# EAGLE schematic BusPirate-ultra-proto-pwr_adc.v.0 (EAGLE 9.1.3)
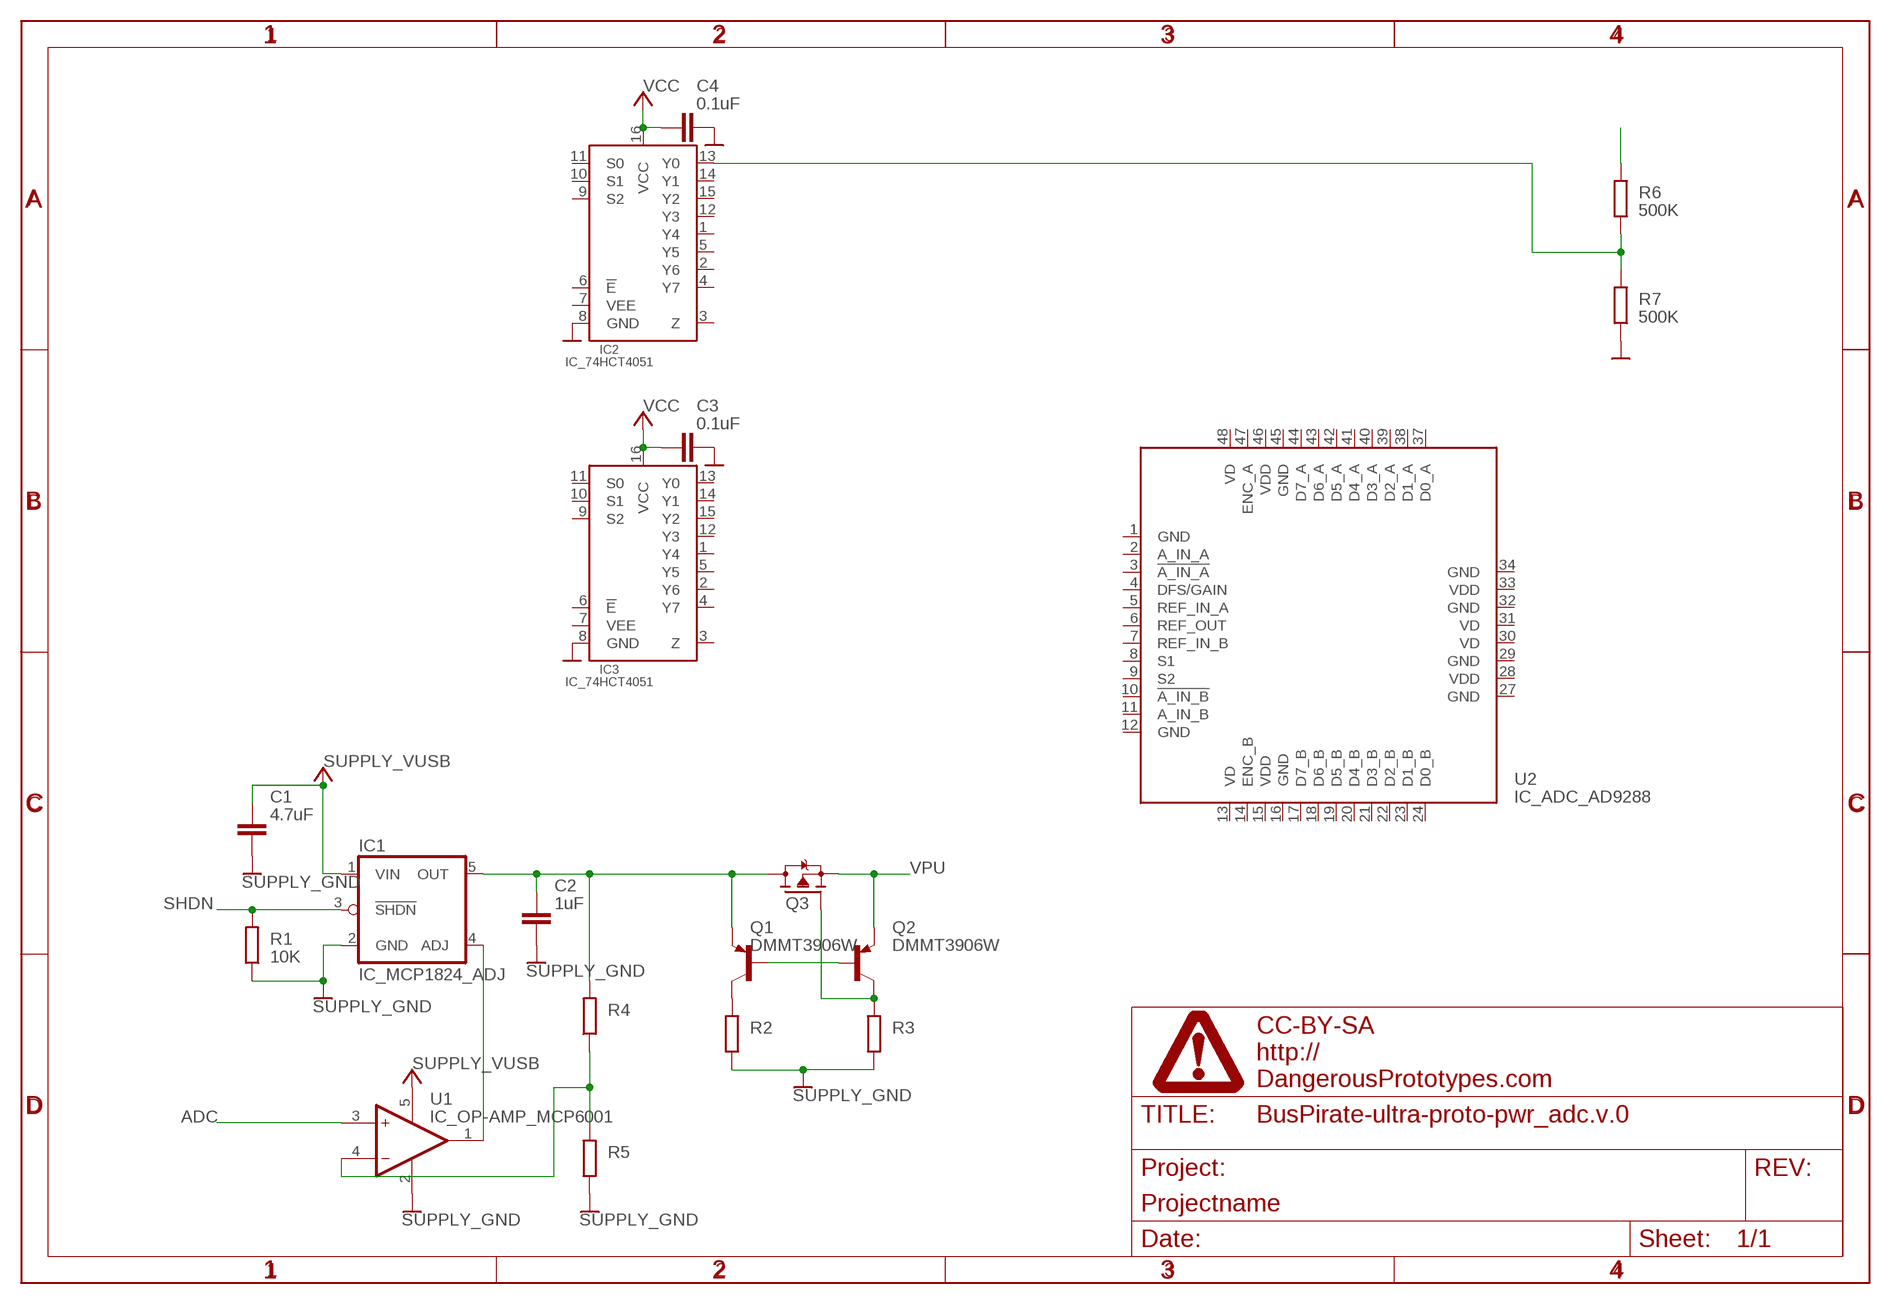
[diagram p0: schematic, sheet 1]

## Parts
C1  4.7uF  CAPACITOR_NPOL-0603  [C603]
C2  1uF  CAPACITOR_NPOL-0603  [C603]
C3  0.1uF  CAPACITOR_NPOL-0603  [C603]
C4  0.1uF  CAPACITOR_NPOL-0603  [C603]
IC1  IC_MCP1824_ADJ  [SOT-23-5]
IC2  IC_74HCT4051  [TSSOP-16]
IC3  IC_74HCT4051  [TSSOP-16]
PAGE1  FRAME_DINA4_L  [DP_LOGO]
Q1  DMMT3906W  TRANSISTOR_BJT_PNP-SOT-23-EBC  [SOT-23]
Q2  DMMT3906W  TRANSISTOR_BJT_PNP-SOT-23-EBC  [SOT-23]
Q3  TRANSISTOR_FET_TSM2301CX  [SOT-23]
R1  10K  RESISTOR-0603  [R603]
R2  RESISTOR-0603  [R603]
R3  RESISTOR-0603  [R603]
R4  RESISTOR-0603  [R603]
R5  RESISTOR-0603  [R603]
R6  500K  RESISTOR-0603  [R603]
R7  500K  RESISTOR-0603  [R603]
U1  IC_OP-AMP_MCP6001  [SOT-23-5]
U2  IC_ADC_AD9288  [LQFP48]

## Nets
ADC: U1.3(+)
GND: C1.2 C2.2 C3.2 C4.2 IC1.2(GND) IC2.8(GND) IC3.8(GND) R1.1 R2.1 R3.1 R5.1 R7.1 U1.2(V-) ; supply symbol labelled SUPPLY_GND
N$1: C2.1 IC1.5(OUT) Q1.1(E) Q3.3(D) R4.2
N$2: IC2.13(Y0) R6.1 R7.2
N$3: Q1.3(C) R2.2
N$4: Q2.3(C) Q3.1(G) R3.2
N$5: Q1.2(B) Q2.2(B)
N$6: IC1.4(ADJ) U1.1(OUT)
N$7: R4.1 R5.2 U1.4(-)
N$8: R6.2
SHDN: IC1.3(!SHDN) R1.2
VCC: C3.1 C4.1 IC2.16(VCC) IC3.16(VCC)
VPU: Q2.1(E) Q3.2(S)
VUSB: C1.1 IC1.1(VIN) U1.5(V+) ; supply symbol labelled SUPPLY_VUSB
Unconnected: IC2.1(Y4) IC2.2(Y6) IC2.3(Z) IC2.4(Y7) IC2.5(Y5) IC2.6(!E) IC2.9(S2) IC2.10(S1) IC2.11(S0) IC2.12(Y3) IC2.14(Y1) IC2.15(Y2) IC3.1(Y4) IC3.2(Y6) IC3.3(Z) IC3.4(Y7) IC3.5(Y5) IC3.6(!E) IC3.9(S2) IC3.10(S1) IC3.11(S0) IC3.12(Y3) IC3.13(Y0) IC3.14(Y1) IC3.15(Y2) U2.2(A_IN_A) U2.3(!A_IN_A) U2.4(DFS/GAIN) U2.5(REF_IN_A) U2.6(REF_OUT) U2.7(REF_IN_B) U2.8(S1) U2.9(S2) U2.10(!A_IN_B) U2.11(A_IN_B) U2.14(ENC_B) U2.17(D7_B) U2.18(D6_B) U2.19(D5_B) U2.20(D4_B) U2.21(D3_B) U2.22(D2_B) U2.23(D1_B) U2.24(D0_B) U2.37(D0_A) U2.38(D1_A) U2.39(D2_A) U2.40(D3_A) U2.41(D4_A) U2.42(D5_A) U2.43(D6_A) U2.44(D7_A) U2.47(ENC_A)

## Power pins joined to a net without a drawn wire
GND: U2.1(GND) U2.12(GND) U2.16(GND) U2.27(GND) U2.29(GND) U2.32(GND) U2.34(GND) U2.45(GND)
VD: U2.13(VD) U2.30(VD) U2.31(VD) U2.48(VD)
VDD: U2.15(VDD) U2.28(VDD) U2.33(VDD) U2.46(VDD)
VEE: IC2.7(VEE) IC3.7(VEE)

## Library data of the parts
C1-C4 = dp_devices.v6:CAPACITOR_NPOL: Non-Polarized capacitor in various packages
IC1 = dp_devices.v6:IC_MCP1824_ADJ: MCP1824 ADJ 300mA, Low voltage, Low Quiescent current adjustable LDO regulator
IC2 IC3 = dp_devices.v6:IC_74HCT4051: 74HCT4051 8-channel analog mux/demux
PAGE1 = dp_devices.v6:FRAME_DINA4_L: A4 DP frame Standard Dangerous Prototypes schematic frame. Automagically adds the DP logo and standard texts to the PCB Use the atrribute in the schematic editor to change the fields.; FF1: fulfillment by; FF2: Seeed Studio; FF3: www.seeedstudio.com; LICENSE: CC-BY-SA; PROJECT: Projectname; URL1: http://; URL2: DangerousPrototypes.com
Q1 Q2 = dp_devices.v6:TRANSISTOR_BJT_PNP: Most commonly used is SOT23-BEC
Q3 = dp_devices.v6:TRANSISTOR_FET_TSM2301CX: 20V P-Channel Enhancement Mode MOSFET
R1-R7 = dp_devices.v6:RESISTOR
U1 = dp_devices.v6:IC_OP-AMP_MCP6001: 1 MHz, Low-Power Op Amp
U2 = dp_devices.v6:IC_ADC_AD9288: 8-Bit, 40/80/100 MSPS Dual A/D Converter